# EasyEDA Pro project Automatic Night Light.eprj

# Schematic Schematic1
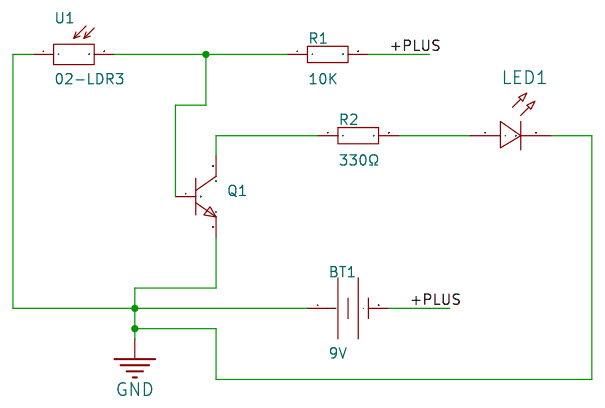
[diagram p0: schematic sheet]

## Parts
BT1  9V  [BAT-TH_2P-9VBATTERY]
LED1  -  [LED0402-RD_YELLOW]
Q1  -  [SOT-23_L2.9-W1.3-P1.90-LS2.4-BR]
R1  10K  [R0603]
R2  330Ω  [R0603]
U1  02-LDR3  [RES-TH_L5.0-W4.3-P3.40-D0.5]

## Library data of the parts
BT1 = 9V电池铜线扣 铜100mm: Connector Type:Battery clip Battery Type:9V laminated battery Operating Temperature:- Operating Temperature:-; Supplier Part: C70374; Manufacturer: Q&J; JLCPCB Part Class: Extended Part; Datasheet: https://atta.szlcsc.com/upload/public/pdf/source/20200429/C70374_01DB02D8DA346FEF8FF35244D091244E.pdf; Supplier: LCSC; Connector Type: Battery clip; Battery Type: 9V laminated battery
LED1 = LED_0402-R: Supplier Footprint: 0402
Q1 = S8050_NPN: Supplier Footprint: SOT-23
R1 R2 = Res_0603: Supplier Footprint: 0603
U1 = 02-LDR3: Dark Resistance:10MΩ Cell Resistance @ Illuminance:100kΩ~200kΩ Cell Resistance @ Illuminance:100kΩ~200kΩ Voltage - Max:100V Wavelength - Peak:540nm Rise Time:20ms Fall Time:- Operating Temperature:-30℃~+70℃ Operating Temperature:-30℃~+70℃; Supplier Part: C17361788; Manufacturer: NTE Electronics; Supplier Footprint: 插件; JLCPCB Part Class: Extended Part; Datasheet: https://atta.szlcsc.com/upload/public/pdf/source/231023/C17212927-c29e296f9f17a7fdc47ee9ecd08f118d.pdf; Supplier: LCSC; Dark Resistance: 10MΩ; Cell Resistance @ Illuminance: 100kΩ~200kΩ; Voltage - Max: 100V; Wavelength - Peak: 540nm; Rise Time: 20ms; Operating Temperature: -30℃~+70℃

## Nets
GND: BT1.1(+) LED1.2(C) Q1.2(E) U1.1
+PLUS: BT1.2(-) R1.2
$1N529: Q1.1(B) R1.1 U1.2
$1N549: Q1.3(C) R2.1
$1N553: LED1.1(A) R2.2

# Board PCB1
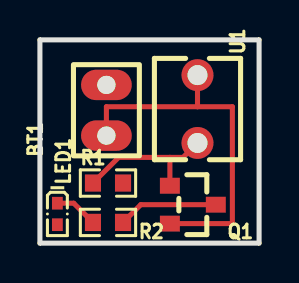
[diagram p1: board, top side]
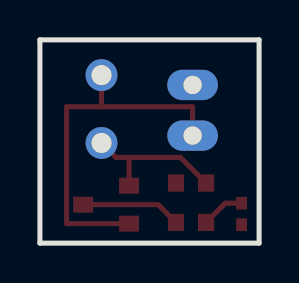
[diagram p2: board, bottom side, seen from below]

Outline 10.98 x 10.19 mm; copper layers: Top Layer, Bottom Layer. Coordinates in mm from the lower left corner of the outline.
Outline path: 0,10.19 10.98,10.19 10.98,0 0,0 0,10.19
Stack: Top Layer 0.035mm / Dielectric1 1.51mm FR4 er 4.5 / Bottom Layer 0.035mm

## Design rules (mm)
template: JLCPCB Capability(Two Layers Board)
spacing copperThickness1oz (default): track to track 0.102, other pairs 0.152 to 0.3
spacing copperThickness2oz: track to track 0.203, other pairs 0.152 to 0.3
track width copperThickness1oz (default): min 0.127, default 0.254, max 2.54
track width copperThickness2oz: min 0.203, default 0.254, max 2.54
differential pair differentialPair (default): width min 0.127, default 0.254, max 2.54; gap min 0.152, default 0.152
via viaSize (default): diameter min 0.5, default 0.61, max 10; hole min 0.3, default 0.305, max 6.3

## Placement (name value [footprint] x y rotation side)
BT1  9V  [BAT-TH_2P-9VBATTERY]  3.33 6.66 90 top
LED1  -  [LED0402-RD_YELLOW]  0.88 1.46 270 top
Q1  -  [SOT-23_L2.9-W1.3-P1.90-LS2.4-BR]  7.66 1.93 180 top
R1  10K  [R0603]  3.41 3.01 0 top
R2  330Ω  [R0603]  3.41 1.04 180 top
U1  02-LDR3  [RES-TH_L5.0-W4.3-P3.40-D0.5]  7.9 6.72 270 top

## Footprints (pads in the part's own frame, mm; a bottom-side part is the same pattern mirrored in y, then rotated)
BAT-TH_2P-9VBATTERY
  oval 1.524x2.54 hole 0.914: 1(-1.27,0) 2(1.27,0)
LED0402-RD_YELLOW
  rect 0.636x0.54 smd: 1(-0.538,0) 2(0.538,0)
R0603
  rect 0.806x0.864 smd: 1(-0.753,0) 2(0.753,0)
RES-TH_L5.0-W4.3-P3.40-D0.5
  round 1.6 hole 1: 1(-1.7,0) 2(1.7,0)
SOT-23_L2.9-W1.3-P1.90-LS2.4-BR
  rect 1x0.8 smd: 1(1.15,-0.95) 2(1.15,0.95) 3(-1.15,0)

## Nets
As in the schematic.

## Routing (per net, layer and track width the routed paths; a pad name or vN(x,y) marks a point on that pad's centre or on a via; arc(x,y) is an arc through that point)
GND: length 18.3
  Top Layer w0.254: BT1.1 3.33,6.84 7.9,6.84 ; 7.9,6.84 U1.1 ; 7.9,6.84 9.64,6.84 9.64,0.98 Q1.2
$1N529: length 7.5
  Top Layer w0.254: 6.51,4.3 3.94,4.3 R1.1 ; 6.51,4.3 7.17,4.3 U1.2 ; 6.51,4.3 Q1.1
$1N549: length 5
  Top Layer w0.254: R2.1 5.05,1.93 Q1.3
$1N553: length 2.2
  Top Layer w0.254: LED1.1 1.69,2 R2.2
